# EAGLE design frankfurt_eth_rev_A (EAGLE 6.6.0)
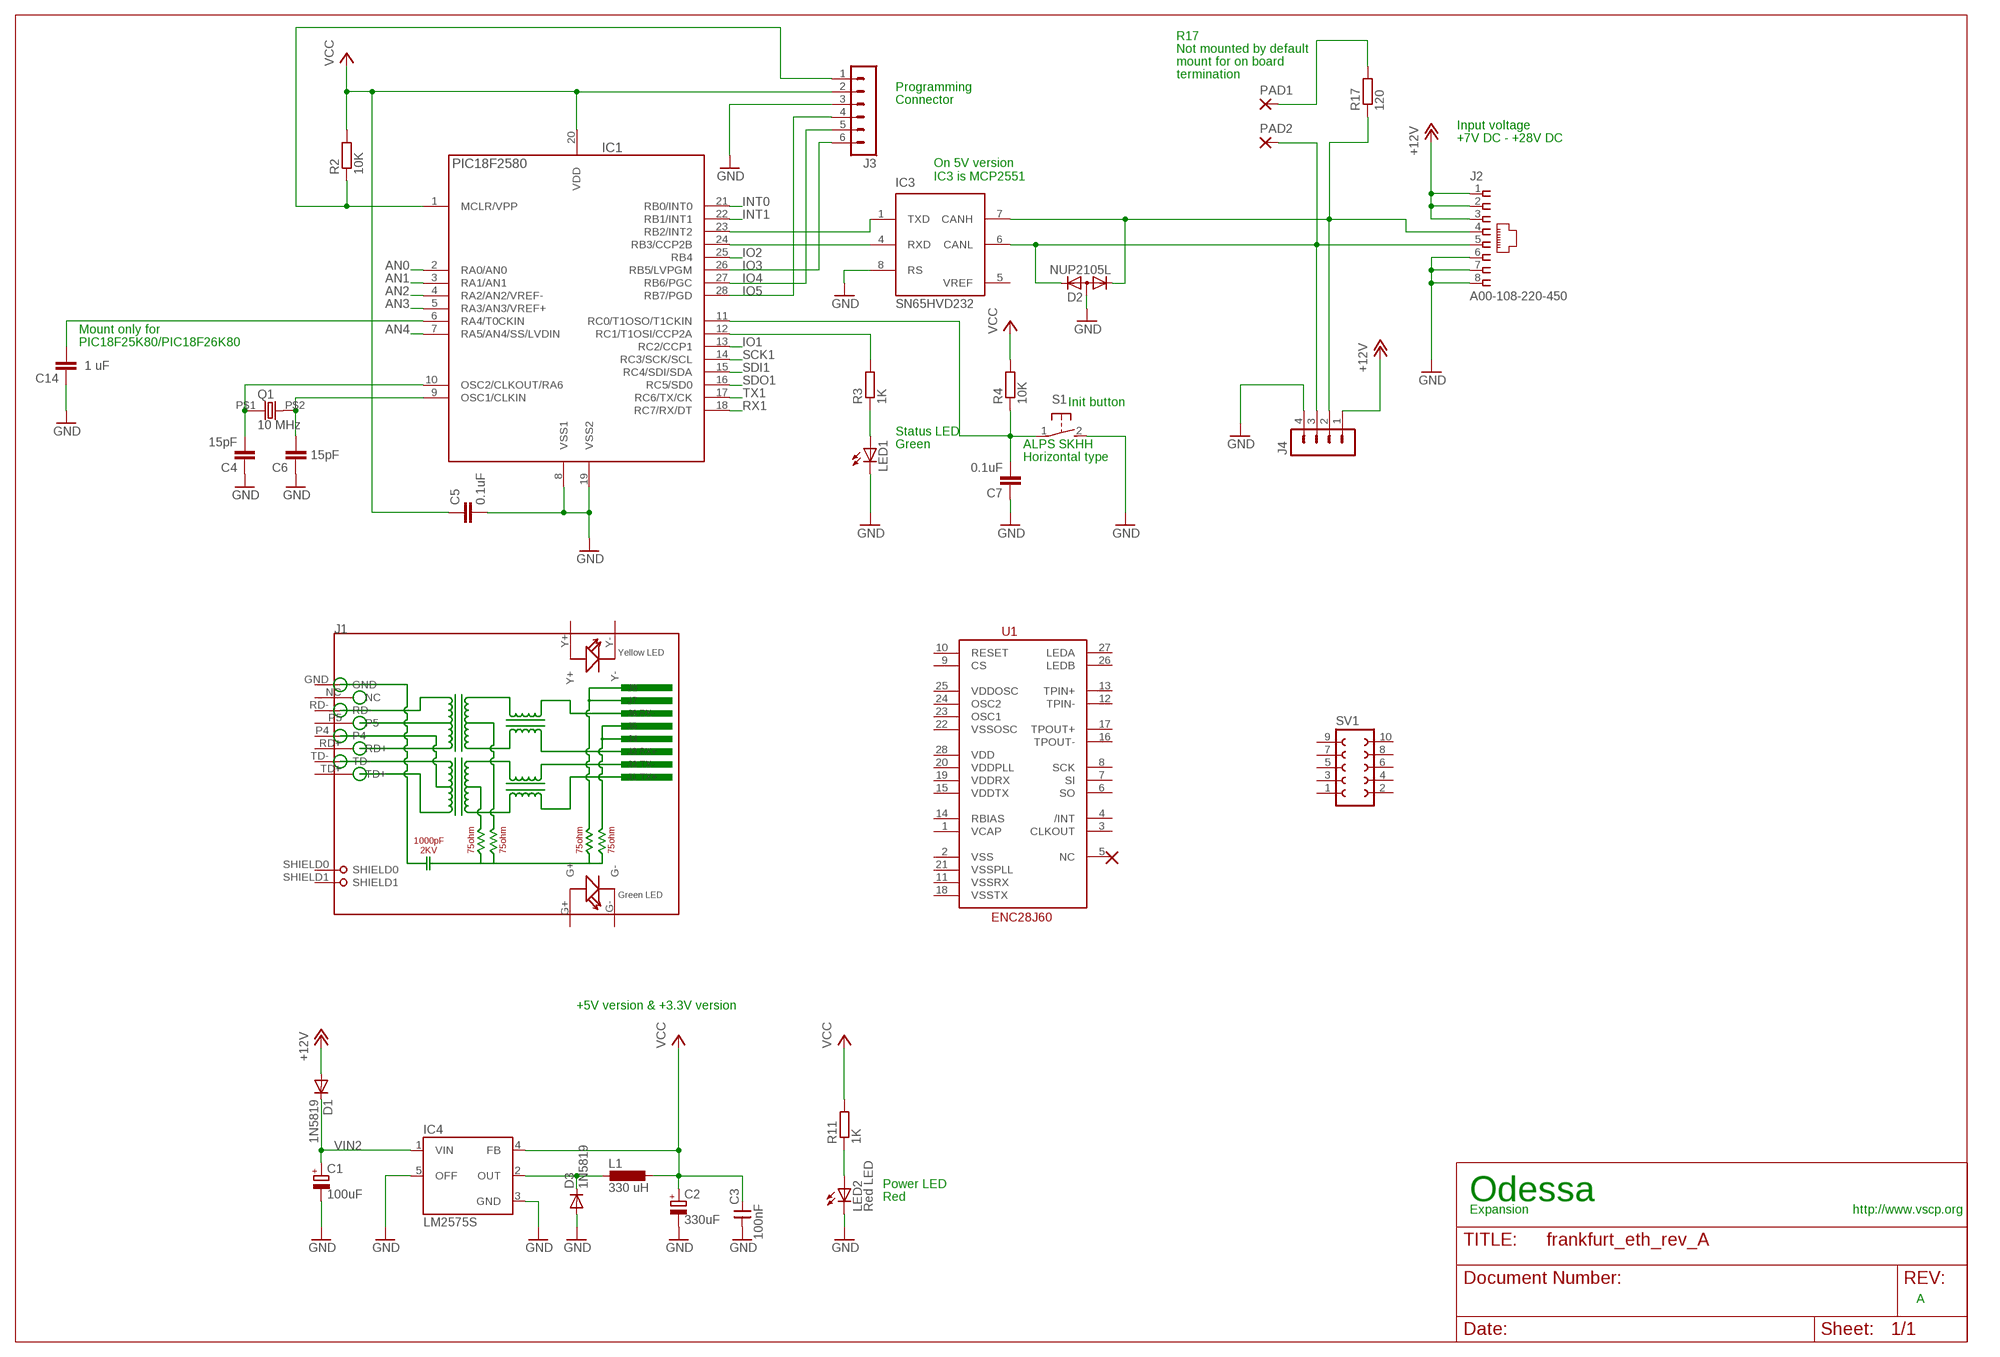
[diagram p0: schematic, sheet 1]

## Parts
C1  100uF  CPOL-EUD  [PANASONIC_D]
C2  330uF  CPOL-EUD  [PANASONIC_D]
C3  100nF  CNP-0805  [0805]
C4  15pF  C-EUC0805  [C0805]
C5  0.1uF  C-EUC0805  [C0805]
C6  15pF  C-EUC0805  [C0805]
C7  0.1uF  C-EUC0805  [C0805]
C14  1 uF  C-EUC0805  [C0805]
D1  1N5819  DIODE-SOD123  [SOD123]
D2  NUP2105L  DIODE-2CA|ACSOT23  [SOT23]
D3  1N5819  DIODE-SOD123  [SOD123]
IC1  PIC18F2580  PIC18LF252-I/SO  [SO28]
IC3  SN65HVD232  MCP2551SN  [SO-08]
IC4  LM2575S  [TO263-5]
J1  RJ45-HR911105A-HR911105A  [RJ45]
J2  A00-108-220-450  [RJ-45]
J3  MA06-1  [MA06-1]
J4  MA04-1  [MA04-1]
L1  330 uH  DO3316P  [DO3316P]
LED1  LEDCHIP-LED0805  [CHIP-LED0805]
LED2  Red LED  LEDCHIP-LED0805  [CHIP-LED0805]
PAD1  1,6/0,8  [1,6/0,8]
PAD2  1,6/0,8  [1,6/0,8]
Q1  10 MHz  HC-49S  [9C]
R2  10K  R-EU_R0805  [R0805]
R3  1K  R-EU_R0805  [R0805]
R4  10K  R-EU_R0805  [R0805]
R11  1K  R-EU_R0805  [R0805]
R17  120  R-EU_R0805  [R0805]
S1  31-XX  [B3F-31XX]
SV1  FE05-2  [FE05-2]
U1  ENC28J60  [SSOP28DB]

## Nets
+12V: D1.A J2.1 J2.2 J2.3 J4.1
AN0: IC1.2(RA0/AN0)
AN1: IC1.3(RA1/AN1)
AN2: IC1.4(RA2/AN2/VREF-)
AN3: IC1.5(RA3/AN3/VREF+)
AN4: IC1.7(RA5/AN4/SS/LVDIN)
CANL: D2.2(K2) IC3.6(CANL) J2.5 J4.3 PAD2.1(P)
GND: C1.- C2.- C3.1 C4.1 C5.2 C6.1 C7.1 C14.1 D2.3(A) D3.A IC1.8(VSS1) IC1.19(VSS2) IC3.8(RS) IC4.3(GND) IC4.5(OFF) J2.6 J2.7 J2.8 J3.3 J4.4 LED1.C LED2.C S1.2(S)
INT0: IC1.21(RB0/INT0)
INT1: IC1.22(RB1/INT1)
IO1: IC1.13(RC2/CCP1)
IO2: IC1.25(RB4)
IO3: IC1.26(RB5/LVPGM) J3.6
IO4: IC1.27(RB6/PGC) J3.5
IO5: IC1.28(RB7/PGD) J3.4
N$1: D3.C IC4.2(OUT) L1.1
N$2: C4.2 IC1.10(OSC2/CLKOUT/RA6) Q1.P$1
N$3: C14.2 IC1.6(RA4/T0CKIN)
N$4: IC1.12(RC1/T1OSI/CCP2A) R3.2
N$5: LED1.A R3.1
N$6: C7.2 IC1.11(RC0/T1OSO/T1CKIN) R4.1 S1.1(P)
N$7: C6.2 IC1.9(OSC1/CLKIN) Q1.P$2
N$11: PAD1.1(P) R17.2
N$20: LED2.A R11.1
N$22: D2.1(K1) IC3.7(CANH) J2.4 J4.2 R17.1
RESET: IC1.1(MCLR/VPP) J3.1 R2.1
RX1: IC1.18(RC7/RX/DT)
RXCAN: IC1.24(RB3/CCP2B) IC3.4(RXD)
SCK1: IC1.14(RC3/SCK/SCL)
SDI1: IC1.15(RC4/SDI/SDA)
SDO1: IC1.16(RC5/SD0)
TX1: IC1.17(RC6/TX/CK)
TXCAN: IC1.23(RB2/INT2) IC3.1(TXD)
VCC: C2.+ C3.2 C5.1 IC1.20(VDD) IC4.4(FB) J3.2 L1.2 R2.2 R4.2 R11.2
VIN2: C1.+ D1.C IC4.1(VIN)
Unconnected: J1.G+ J1.G- J1.GND J1.NC J1.P4 J1.P5 J1.RD+ J1.RD- J1.SHIELD0 J1.SHIELD1 J1.TD+ J1.TD- J1.Y+ J1.Y- SV1.1 SV1.2 SV1.3 SV1.4 SV1.5 SV1.6 SV1.7 SV1.8 SV1.9 SV1.10 U1.1(VCAP) U1.2(VSS) U1.3(CLKOUT) U1.4(/INT) U1.5(NC) U1.6(SO) U1.7(SI) U1.8(SCK) U1.9(CS) U1.10(RESET) U1.11(VSSRX) U1.12(TPIN-) U1.13(TPIN+) U1.14(RBIAS) U1.15(VDDTX) U1.16(TPOUT-) U1.17(TPOUT+) U1.18(VSSTX) U1.19(VDDRX) U1.20(VDDPLL) U1.21(VSSPLL) U1.22(VSSOSC) U1.23(OSC1) U1.24(OSC2) U1.25(VDDOSC) U1.26(LEDB) U1.27(LEDA) U1.28(VDD)

## Notes on the sheet
- R17
- Not mounted by default
- mount for on board
- termination
- Programming
- Connector
- Input voltage
- +7V DC - +28V DC
- On 5V version 
  IC3 is MCP2551
- Mount only for
- PIC18F25K80/PIC18F26K80
- Init button
- Status LED
- Green | ALPS SKHH
- Horizontal type
- +5V version & +3.3V version
- Power LED
- Red | Odessa
- Expansion | http://www.vscp.org
- A

## Power pins joined to a net without a drawn wire
GND: IC3.2(VSS)
VCC: IC3.3(VDD)
VREF: IC3.5(VREF)

## Library data of the parts
C1 C2 = rcl:CPOL-EU: POLARIZED CAPACITOR, European symbol
C3 = cap-master:CNP-: NON-POLARIZED CAP
C4-C7 C14 = rcl:C-EU: CAPACITOR, European symbol
D1 D3 = diode:DIODE-: DIODE
D2 = diode:DIODE-2CA|AC: Dual DIODE Cathode-Anode|Anode-Cathode
IC1 = pic_olin:PIC18*F252-?: 18F252, 28 pin, 32Kb prog, 1536 data, 256 EEPROM
IC3 = microchip_can:MCP2551: High Speed CAN tranceiver
IC4 = v-reg-3:LM2575: National Semiconductor <http://www.national.com> 1.0A "Simple Switcher"(c) 52kHz, Vout 1.23-37V (HV: 57V), Vin 40V (HV: 60V), 50µA standby current
J1 = Connector:RJ45-HR911105A
J2 = vscpcan:A00-108-220-450
J3 = con-lstb:MA06-1: PIN HEADER; OC_FARNELL: unknown; OC_NEWARK: unknown
J4 = con-lstb:MA04-1: PIN HEADER; OC_FARNELL: unknown; OC_NEWARK: unknown
L1 = inductor-coilcraft:DO3316P: COILCRAFT; OC_FARNELL: unknown; OC_NEWARK: unknown
LED1 LED2 = led:LED: LED OSRAM: - CHIPLED LG R971, LG N971, LY N971, LG Q971, LY Q971, LO R971, LY R971 LH N974, LH R974 LS Q976, LO Q976, LY Q976 LO Q996 - Hyper CHIPLED LW Q18S LB Q993, LB Q99A, LB R99A - SideLED LS A670, LO A670, LY A670, LG A670, LP A670 LB A673, LV A673, LT A673, LW A673 LH A674 LY A675 LS A676, LA A676, LO A676, LY A676, LW A676 LS A679, LY A679, LG A679 - Hyper Micro SIDELED® LS Y876, LA Y876, LO Y876, LY Y876 LT Y87S - SmartLED LW L88C, LW L88S LB L89C, LB L89S, LG L890 LS L89K, LO L89K, LY L89K LS L896, LA L896, LO L896, LY L896 - TOPLED LS T670, LO T670, LY T670, LG T670, LP T670 LSG T670, LSP T670, LSY T670, LOP T670, LYG T670 LG T671, LOG T671, LSG T671 LB T673, LV T673, LT T673, LW T673 LH T674 LS T676, LA T676, LO T676, LY T676, LB T676, LH T676, LSB T676, LW T676 LB T67C, LV T67C, LT T67C, LS T67K, LO T67K, LY T67K, LW E67C LS E67B, LA E67B, LO E67B, LY E67B, LB E67C, LV E67C, LT E67C LW T67C LS T679, LY T679, LG T679 LS T770, LO T770, LY T770, LG T770, LP T770 LB T773, LV T773, LT T773, LW T773 LH T774 LS E675, LA E675, LY E675, LS T675 LS T776, LA T776, LO T776, LY T776, LB T776 LHGB T686 LT T68C, LB T68C - Hyper Mini TOPLED® LB M676 - Mini TOPLED Santana® LG M470 LS M47K, LO M47K, LY M47K Source: http://www.osram.convergy.de LUXEON: - LUMILED® LXK2-PW12-R00, LXK2-PW12-S00, LXK2-PW14-U00, LXK2-PW14-V00 LXK2-PM12-R00, LXK2-PM12-S00, LXK2-PM14-U00 LXK2-PE12-Q00, LXK2-PE12-R00, LXK2-PE12-S00, LXK2-PE14-T00, LXK2-PE14-U00 LXK2-PB12-K00, LXK2-PB12-L00, LXK2-PB12-M00, LXK2-PB14-N00, LXK2-PB14-P00, LXK2-PB14-Q00 LXK2-PR12-L00, LXK2-PR12-M00, LXK2-PR14-Q00, LXK2-PR14-R00 LXK2-PD12-Q00, LXK2-PD12-R00, LXK2-PD12-S00 LXK2-PH12-R00, LXK2-PH12-S00 LXK2-PL12-P00, LXK2-PL12-Q00, LXK2-PL12-R00 Source: www.luxeon.com KINGBRIGHT: KA-3528ASYC Source: www.kingbright.com
PAD1 PAD2 = wirepad:1,6/0,8: THROUGH-HOLE PAD
Q1 = vscpcan:HC-49S: Digikey 887-1050-1-nd
R2-R4 R11 R17 = rcl:R-EU_: RESISTOR, European symbol
S1 = switch-omron:31-XX: OMRON SWITCH; MPN: B3F-3100; OC_FARNELL: 959704; OC_NEWARK: 36M3582
SV1 = con-lsta:FE05-2: FEMALE HEADER; OC_FARNELL: unknown; OC_NEWARK: unknown
U1 = SparkFun-DigitalIC:ENC28J60: Microchip SPI 10Base ethernet IC

## Board
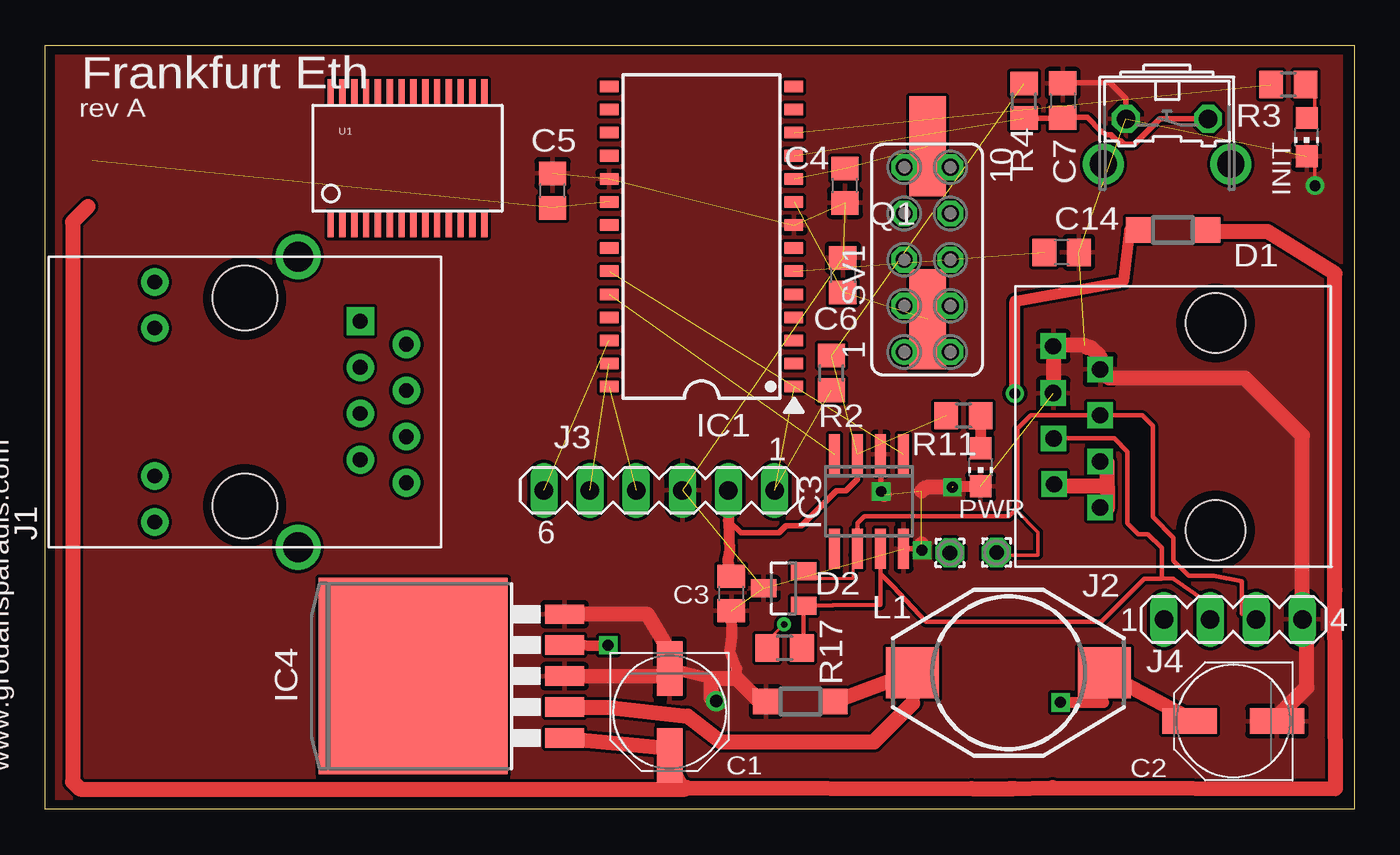
[diagram p1: board, top side]
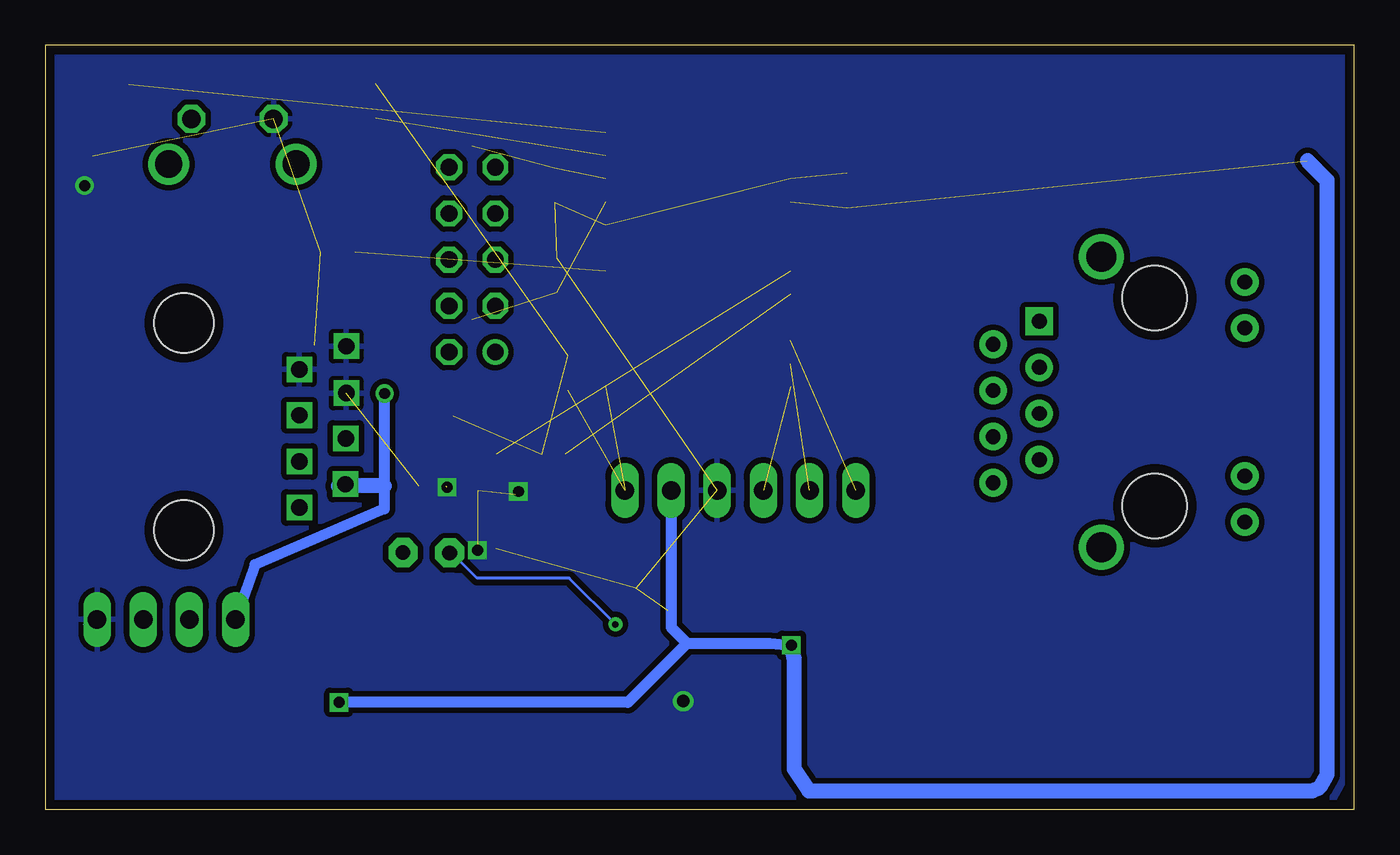
[diagram p2: board, bottom side, seen from below]

Size 72 x 42 mm. Coordinates in mm from the lower left corner, seen from the top.
Outline: 0,0 0,42 72,42 72,0 0,0
Copper layers (1*16): Top 0.0356mm / dielectric 1.5011mm / Bottom 0.0356mm
Design rules "SilverCircuits": minimum track width 7mil, minimum drill 14mil, track to track 7mil, track to pad 7mil, pad to pad 7mil, via to via 7mil, smd to smd 0mil, copper to edge 20mil, drill to drill 8mil, minimum pad ring 10mil, minimum via ring 8mil, stop-mask expansion 4mil, vias tented up to drill 0mil, thermal gap 10mil

### Footprints (pad centres in the part's own frame; a part is rotated, then mirrored left to right if it is on the bottom)
PANASONIC_D = smd 3 x 1.4: + 2.4,0; - -2.4,0
0805 = smd 1.27 x 1.524: 1 -0.953,0; 2 0.953,0
C0805 = smd 1.3 x 1.5: 1 -0.95,0; 2 0.95,0
SOD123 = smd 1.4 x 1.4: A 1.9,0; C -1.9,0
SOT23 = smd 1 x 1.4: 1 -0.95,-1.1; 2 0.95,-1.1; 3 0,1.1
SO28 = smd 0.635 x 1.016: 1 -8.255,-5.08; 2 -6.985,-5.08; 3 -5.715,-5.08; 4 -4.445,-5.08; 5 -3.175,-5.08; 6 -1.905,-5.08; 7 -0.635,-5.08; 8 0.635,-5.08; 9 1.905,-5.08; 10 3.175,-5.08; 11 4.445,-5.08; 12 5.715,-5.08; 13 6.985,-5.08; 14 8.255,-5.08; 15 8.255,5.08; 16 6.985,5.08; 17 5.715,5.08; 18 4.445,5.08; 19 3.175,5.08; 20 1.905,5.08; 21 0.635,5.08; 22 -0.635,5.08; 23 -1.905,5.08; 24 -3.175,5.08; 25 -4.445,5.08; 26 -5.715,5.08; 27 -6.985,5.08; 28 -8.255,5.08
SO-08 = smd 0.6 x 2.2: 1 -1.905,-2.6; 2 -0.635,-2.6; 3 0.635,-2.6; 4 1.905,-2.6; 5 1.905,2.6; 6 0.635,2.6; 7 -0.635,2.6; 8 -1.905,2.6
TO263-5 = smd 1.067 x 2.159: 1 -3.404,-5.791; 2 -1.702,-5.791; 3 0,-5.791; 4 1.702,-5.791; 5 3.404,-5.791 | smd 10.8 x 10.41: 6 0,2.54
RJ45 = drill 0.813 pad 1.524: G+ 4.953,-6.604; G- 4.953,-4.064; GND -8.89,4.445; NC -6.35,3.175; P4 -8.89,-0.635; P5 -6.35,0.635; RD+ -6.35,-1.905; RD- -8.89,1.905; TD- -8.89,-3.175; Y+ 4.953,6.604; Y- 4.953,4.064 | drill 1.651 pad 2.159: SHIELD0 -2.921,8.001; SHIELD1 -2.921,-8.001 | drill 0.813 pad 1.524 square: TD+ -6.35,-4.445 | hole 3.556: 0,-5.715; 0,5.715
RJ-45 = drill 0.9 square: 1 -4.45,6.35; 2 -3.17,8.89; 3 -1.92,6.36; 4 -0.65,8.91; 5 0.62,6.35; 6 1.84,8.93; 7 3.14,6.35; 8 4.42,8.93 | hole 3.3: -5.7,0; 5.7,0
MA06-1 = drill 1.016 long: 1 -6.35,0; 2 -3.81,0; 3 -1.27,0; 4 1.27,0; 5 3.81,0; 6 6.35,0
MA04-1 = drill 1.016 long: 1 -3.81,0; 2 -1.27,0; 3 1.27,0; 4 3.81,0
DO3316P = smd 2.92 x 2.79: 1 -5.28,0; 2 5.28,0
CHIP-LED0805 = smd 1.2 x 1.2: A 0,-1.05; C 0,1.05
1,6/0,8 = drill 0.813 pad 1.6 octagon: 1 0,0
9C = smd 5.5 x 2: P$1 -4.74,0; P$2 4.76,0
R0805 = smd 1.3 x 1.5: 1 -0.95,0; 2 0.95,0
B3F-31XX = drill 1.016 octagon: 1 -2.261,-1.245; 2 2.261,-1.245 | drill 1.499 pad 2.159: 3 -3.505,1.245; 4 3.505,1.245
FE05-2 = drill 0.914: 1 -5.08,1.27 | drill 0.914 octagon: 2 -5.08,-1.27; 3 -2.54,1.27; 4 -2.54,-1.27; 5 0,1.27; 6 0,-1.27; 7 2.54,1.27; 8 2.54,-1.27; 9 5.08,1.27; 10 5.08,-1.27
SSOP28DB = smd 0.348 x 1.397: 1 -4.225,-3.656; 2 -3.575,-3.656; 3 -2.925,-3.656; 4 -2.275,-3.656; 5 -1.625,-3.656; 6 -0.975,-3.656; 7 -0.325,-3.656; 8 0.325,-3.656; 9 0.975,-3.656; 10 1.625,-3.656; 11 2.275,-3.656; 12 2.925,-3.656; 13 3.575,-3.656; 14 4.225,-3.656; 15 4.225,3.656; 16 3.575,3.656; 17 2.925,3.656; 18 2.275,3.656; 19 1.625,3.656; 20 0.975,3.656; 21 0.325,3.656; 22 -0.325,3.656; 23 -0.975,3.656; 24 -1.625,3.656; 25 -2.275,3.656; 26 -2.925,3.656; 27 -3.575,3.656; 28 -4.225,3.656

### Placement (x,y rotation side)
C1  34.34,5.34 270 top
C2  65.36,4.84 180 top
C3  37.74,11.86 90 top
C4  43.98,34.29 90 top
C5  27.9,34.01 90 top
C6  43.87,29.37 270 top
C7  55.97,38.97 270 top
C14  55.91,30.62 180 top
D1  62.04,31.86 180 top
D2  40.61,12.14 90 top
D3  41.53,5.91 180 top
IC1  36.1,31.49 90 top
IC3  45.31,16.93 180 top
IC4  22.77,7.31 90 top
J1  10.97,22.39 180 top
J2  64.38,21.04 90 top
J3  33.77,17.53 180 top
J4  65.35,10.43 0 top
L1  52.99,7.5 0 top
LED1  69.39,36.96 180 top
LED2  51.45,18.8 180 top
PAD1  49.76,14.09 0 top
PAD2  52.33,14.11 0 top
Q1  48.53,31.71 270 top
R2  43.24,23.99 90 top
R3  68.38,39.85 180 top
R4  53.84,38.95 90 top
R11  50.51,21.64 180 top
R17  40.67,8.86 180 top
S1  61.71,36.72 180 top
SV1  48.52,30.22 90 top
U1  19.92,35.8 0 top

### Tracks (layer width: path | path; a pad name or v marks a point on that pad's centre or on a via)
+12V  (via drill 0.6)
  Top 0.178: 59.69,31.75 59.66,31.86
  Top 0.203: J2.2 55.88,17.78 | 58.42,16.51 J2.1 | 59.69,31.75 D1.A
  Top 0.406: D1.A 59.82,31.84
  Top 0.61: 60.01,31.97 59.66,31.86 59.67,31.77 59.33,29.06 59.27,29.01 53.34,27.94 v53.34,22.86
  Top 0.813: 55.88,17.78 58.42,17.78 | 58.42,17.78 58.42,19.05 J2.3 | 58.42,17.78 58.42,16.51
  Bottom 0.203: 55.88,17.78 J2.2
  Bottom 0.61: v53.34,22.86 53.34,17.78 53.34,16.51 60.47,13.44 J4.1
  Bottom 0.813: 53.34,17.78 55.88,17.78
CANL
  Top 0.178: 44.45,13.97 44.45,12.7 41.91,12.7 D2.2
  Top 0.203: D2.2 42.45,12.74 | 44.45,13.97 IC3.6 | PAD2.1 52.07,13.97 54.61,13.97 54.61,15.24 53.38,16.46 53.34,16.51
  Top 0.254: J4.3 65.81,10.75 65.81,12.53 64.29,12.83 62.9,12.83 62.06,13.67 62.06,14.93 60.92,16.07 60.92,21.09 60.35,21.66 J2.5 54.21,21.66 53.48,20.93 53.48,16.56 53.38,16.46 53.02,16.1 45.06,16.1 44.67,15.71 IC3.6
GND  (via drill 0.6, 0.7)  (15 unrouted)
  Top 0.203: v69.85,34.29 69.85,35.56 LED1.C
  Top 0.254: 36.63,7.18 36.63,7.36
  Top 0.305: IC3.8 48.14,14.33 v48.23,14.24 | v45.98,17.47 45.98,19.5 IC3.2 | S1.2 59.45,39.06 58.55,39.96 56.01,39.96 C7.1
  Top 0.61: 34.05,7.32 34.33,6.65 34.62,7.21 34.65,7.18 | 34.65,7.18 34.7,7.13 | 34.65,7.18 C1.- | 39.42,5.79 39.33,5.88 D3.A 39.48,5.91 | C1.- 36.63,7.18 | 39.48,5.91 39.58,5.81 | 39.48,5.91 38.93,6.46 | 34.44,7.15 34.34,7.05 | C1.- 34.44,7.15 | 34.47,8.45 34.47,7.18 34.44,7.15 | 36.63,6.09 v36.91,5.94 | 38.02,7.18 38.02,7.75 37.66,8.68 37.76,9.48 C3.1 | 49.95,17.75 LED2.C
  Top 0.813: IC4.3 34.05,7.32 | 39.33,5.88 38.02,7.18 36.63,7.18 36.63,6.09 | IC4.5 33.14,10.71 34.47,8.45 | C2.- 67.76,5.06 69.4,6.7 69.4,10.19 J4.4 69.16,20.54 66,23.7 58.51,23.7 J2.7 58.03,24.87 57.5,25.4 57.3,25.4 57.2,25.5 55.49,25.5 J2.8 J2.6 | v49.9,17.7 48.5,17.7 48.2,17.5 | 46.15,17.3 v45.98,17.47 | 48.2,14.57 v48.23,14.24
  Bottom 0.178: J4.4 69.85,10.16 69.26,10.33
  pour Bottom (isolate 0.305): 0.5,1.58 1.26,0.23 71.64,0.46 71.48,1.13 71.5,34.3 71.42,41.86 0.33,41.86 0.51,33.68
  pour Top: 0.57,41.92 0.56,41.52 0.56,0.32 71.6,0.32 71.6,0.81 71.28,0.81 71.28,41.6 2.5,41.9 2.1,41.85
IO3  (1 unrouted)
IO4  (1 unrouted)
IO5  (1 unrouted)
  Top 0.305: J3.4 32.52,17.55
N$1
  Top 0.61: 47.83,5.86 47.78,5.91 L1.1 47.71,5.81 | IC4.2 29.15,5.65 29.03,5.59
  Top 0.813: L1.1 D3.C | 47.71,5.81 45.6,3.7 37.16,3.7 35.35,5.11 30.92,5.6 28.61,5.6 29.15,5.65
N$2  (2 unrouted)
N$3  (1 unrouted)
N$4  (1 unrouted)
N$5
  Top 0.203: 69.85,39.37 69.85,38.1 LED1.A
  Top 0.254: 69.85,39.37 R3.1
N$6  (1 unrouted)
  Top 0.305: R4.1 55.95,38 C7.2 55.99,38.04 57.32,38.04 58.07,37.29 58.13,37.29 58.33,37.09 58.62,37.09 58.95,36.76 59.14,36.76 59.33,36.57 59.92,36.57 61.31,37.97 S1.1
N$7  (2 unrouted)
N$11  (via drill 0.36)
  Top 0.178: v40.64,10.16 39.37,8.89 R17.2
  Bottom 0.178: v40.64,10.16 43.18,12.7 48.26,12.7 49.53,13.97 PAD1.1
N$20
  Top 0.61: R11.1 LED2.A
N$22
  Top 0.254: 45.95,12.95 IC3.7 | 45.95,12.95 46.61,12.28 48.43,10.3 58.1,10.3 60.46,12.66 61.37,12.66 61.41,12.7 | 61.41,12.7 61.41,14.38 60.66,15.13 60.12,15.13 59.53,15.72 59.53,19.66 58.8,20.39 J2.4 | 61.41,12.7 62.05,12.66 63.78,11.47 J4.2 | 45.95,12.95 45.93,12.93 45.93,11.23 43.34,11.2 D2.1 41.71,8.95 R17.1
  Top 0.305: IC3.7 45.92,14.3
RESET  (2 unrouted)
RXCAN  (1 unrouted)
TXCAN  (1 unrouted)
VCC  (via drill 0.6)  (5 unrouted)
  Top 0.305: v30.96,9.01 30.96,8.96 | IC3.3 44.67,18.14 44.03,17.5 43.51,17.5 41.59,15.58 40.74,15.58 40.35,15.19 38.26,15.19 37.58,15.87 | 58.23,5.87 L1.2
  Top 0.406: 63.05,4.95 C2.+
  Top 0.61: 30.96,8.96 IC4.4 | C3.2 37.53,13.65 37.63,14.12 37.58,15.87 J3.2 | v55.85,5.87 58.23,5.87
  Top 0.813: L1.2 63.05,4.95
  Bottom 0.61: J3.2 37.58,9.99 36.71,9.12 | 36.71,9.12 32.14,9.12 v30.96,9.01 | v55.85,5.87 39.96,5.87 36.71,9.12
  Bottom 0.813: 2.57,35.67 1.5,34.6 1.5,1.9 1.9,1.2 2.3,1 30,1 30.8,2.2 30.8,8.25 v30.96,9.01
VIN2
  Top 0.406: 34.35,3.36 C1.+ 35.27,1.18 | D1.C 64.48,31.86 64.58,31.76
  Top 0.813: IC4.1 34.35,3.36 | 64.58,31.76 67.25,31.76 70.95,29.46 70.95,12.05 70.98,1.12 55.42,1.18 53.07,1.13 53.29,1.12 50.97,1.13 35.27,1.18 35.19,1.1 1.9,1.1 1.5,1.5 1.5,32.3 2.33,33.13

### Text on the board
tNames: Frankfurt Eth | rev A | INIT | PWR | www.grodansparadis.com